# Altium project CKCANTerminator.PrjPcb
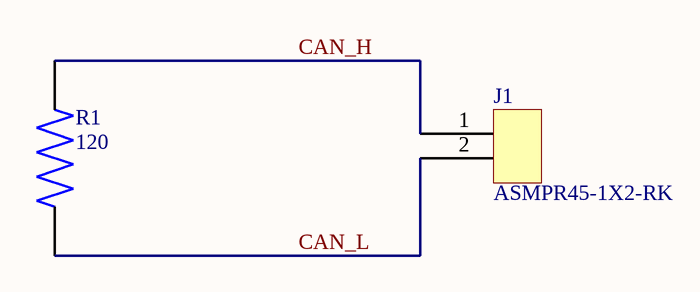
[diagram p0: CANTerm.SchDoc]
1 sheet, 2 parts. Net scope: global (net labels, ports and power ports of the same name join across sheets).
Board file: CANTerm.PcbDoc

## Sheet CANTerm.SchDoc
size A; SheetNumber: 1; SheetTotal: 1

### Parts
J1  ASMPR45-1X2-RK  [APP_ASMPR45-1X2-RK]
R1  120  [R0805]

### Nets
CAN_H: J1.1 R1.2
CAN_L: J1.2 R1.1

### Library data of the parts
J1 = ASMPR45-1X2-RK: C-powerpoles 10 / 45, PP15/45 1X2 45 Amp Horizontal Pcb Assembly Red, Blk.; Manufacturer: Anderson Power; Supplier 1: Digi-Key; Manufacturer Part Number: ASMPR45-1X2-RK; RoHS: No; Category: Connectors; Stock 1: 801; Pricing 1: 1=4.44000, 10=4.02800, 25=3.81520, 50=3.72640, 100=3.54900, 250=3.10536, 500=3.01664, 1000=2.57302, 2500=2.39558 (USD); Supplier Part Number 1: 2243-ASMPR45-1X2-RK-ND
R1 = CRGCQ0805F120R: Fixed Resistor CRGCQ 0805 120R 1%; MF: TE Connectivity; SnapEDA_Link: https://www.snapeda.com/parts/CRGCQ0805F120R/TE%20Connectivity/view-part/3187861/?ref=snap; Availability: Unavailable; TE_purchase_URL: https://www.te.com/usa-en/product-1-2176341-4.html?te_bu=Cor&te_type=disp&te_campaign=seda_glo_cor-seda-global-disp-prtnr-fy19-seda-model-bom-cta_sma-317_1&elqCampaignId=32493; MP: CRGCQ0805F120R; Price: None; Value: *; Package: 2012 TE Connectivity